# EAGLE design benzinPWM_v1 (EAGLE 5.10)
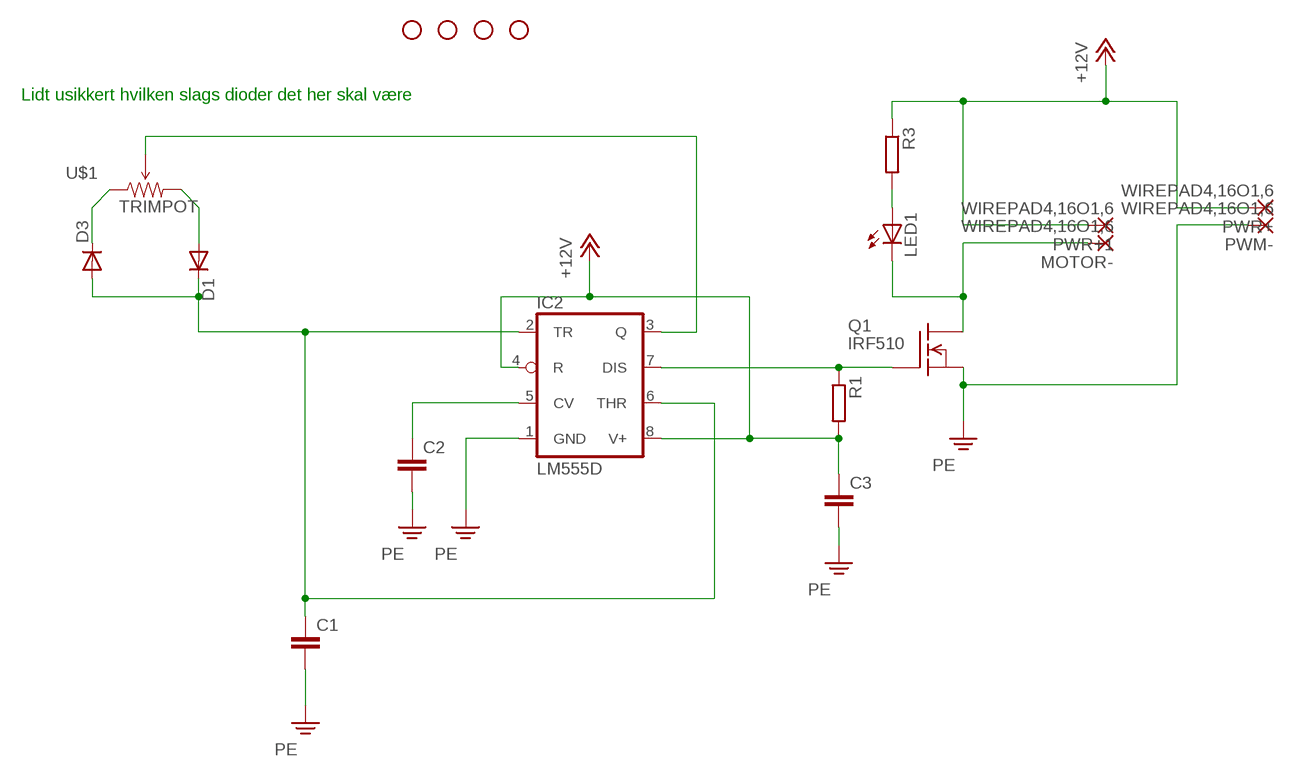
[diagram p0: schematic, sheet 1]

## Parts
C1  C-EUC0805  [C0805]
C2  C-EUC0805  [C0805]
C3  C-EUC0805  [C0805]
D1  DIODE-GF1  [GF1]
D3  DIODE-GF1  [GF1]
IC2  LM555D  [SO08]
JP3  STAND-OFF  [STAND-OFF]
JP4  STAND-OFF  [STAND-OFF]
JP5  STAND-OFF  [STAND-OFF]
JP6  STAND-OFF  [STAND-OFF]
LED1  LEDCHIPLED_0805  [CHIPLED_0805]
MOTOR-  WIREPAD4,16O1,6  [4,16O1,6]
PWM-  WIREPAD4,16O1,6  [4,16O1,6]
PWR+  WIREPAD4,16O1,6  [4,16O1,6]
PWR+1  WIREPAD4,16O1,6  [4,16O1,6]
Q1  IRF510  [TO220]
R1  R-EU_M0805  [M0805]
R3  R-EU_M0805  [M0805]
U$1  TRIMPOT  [3362U-2]

## Nets
+12V: C3.1 IC2.4(R) IC2.8(V+) PWR+1.1(P) PWR+.1(P) R1.2 R3.1
N$1: C1.1 D1.C D3.A IC2.2(TR) IC2.6(THR)
N$2: D1.A U$1.3(CW)
N$3: D3.C U$1.1(CCW)
N$5: C2.1 IC2.5(CV)
N$6: IC2.7(DIS) Q1.1(G) R1.1
N$7: LED1.A R3.2
N$8: IC2.3(Q) U$1.2(WIPER)
N$10: LED1.C MOTOR-.1(P) Q1.2(D)
PE: C1.2 C2.2 C3.2 IC2.1(GND) PWM-.1(P) Q1.3(S)

## Notes on the sheet
- Lidt usikkert hvilken slags dioder det her skal være

## Library data of the parts
C1-C3 = rcl:C-EU: CAPACITOR, European symbol
D1 D3 = diode:DIODE-: DIODE
IC2 = linear:*555: TIMER
JP3-JP6 = SparkFun:STAND-OFF: Stand Off This is the mechanical footprint for a #4 phillips button head screw. Use the keepout ring to avoid running the screw head into surrounding components. SKU : PRT-00447
LED1 = led:LED: LED OSRAM: - CHIPLED LG R971, LG N971, LY N971, LG Q971, LY Q971, LO R971, LY R971 LH N974, LH R974 LS Q976, LO Q976, LY Q976 LO Q996 - Hyper CHIPLED LW Q18S LB Q993, LB Q99A, LB R99A - SideLED LS A670, LO A670, LY A670, LG A670, LP A670 LB A673, LV A673, LT A673, LW A673 LH A674 LY A675 LS A676, LA A676, LO A676, LY A676, LW A676 LS A679, LY A679, LG A679 - Hyper Micro SIDELED® LS Y876, LA Y876, LO Y876, LY Y876 LT Y87S - SmartLED LW L88C, LW L88S LB L89C, LB L89S, LG L890 LS L89K, LO L89K, LY L89K LS L896, LA L896, LO L896, LY L896 - TOPLED LS T670, LO T670, LY T670, LG T670, LP T670 LSG T670, LSP T670, LSY T670, LOP T670, LYG T670 LG T671, LOG T671, LSG T671 LB T673, LV T673, LT T673, LW T673 LH T674 LS T676, LA T676, LO T676, LY T676, LB T676, LH T676, LSB T676, LW T676 LB T67C, LV T67C, LT T67C, LS T67K, LO T67K, LY T67K, LW E67C LS E67B, LA E67B, LO E67B, LY E67B, LB E67C, LV E67C, LT E67C LW T67C LS T679, LY T679, LG T679 LS T770, LO T770, LY T770, LG T770, LP T770 LB T773, LV T773, LT T773, LW T773 LH T774 LS E675, LA E675, LY E675, LS T675 LS T776, LA T776, LO T776, LY T776, LB T776 LHGB T686 LT T68C, LB T68C - Hyper Mini TOPLED® LB M676 - Mini TOPLED Santana® LG M470 LS M47K, LO M47K, LY M47K Source: http://www.osram.convergy.de LUXEON: - LUMILED® LXK2-PW12-R00, LXK2-PW12-S00, LXK2-PW14-U00, LXK2-PW14-V00 LXK2-PM12-R00, LXK2-PM12-S00, LXK2-PM14-U00 LXK2-PE12-Q00, LXK2-PE12-R00, LXK2-PE12-S00, LXK2-PE14-T00, LXK2-PE14-U00 LXK2-PB12-K00, LXK2-PB12-L00, LXK2-PB12-M00, LXK2-PB14-N00, LXK2-PB14-P00, LXK2-PB14-Q00 LXK2-PR12-L00, LXK2-PR12-M00, LXK2-PR14-Q00, LXK2-PR14-R00 LXK2-PD12-Q00, LXK2-PD12-R00, LXK2-PD12-S00 LXK2-PH12-R00, LXK2-PH12-S00 LXK2-PL12-P00, LXK2-PL12-Q00, LXK2-PL12-R00 Source: www.luxeon.com KINGBRIGHT: KA-3528ASYC Source: www.kingbright.com
MOTOR- PWM- PWR+ PWR+1 = wirepad:WIREPAD: Wire PAD connect wire on PCB
Q1 = transistor-fet:IRF510: N-Channel Enhancement MOSFET (HEXFET); 100V; 5,6A; 0,54Ohm
R1 R3 = resistor:R-EU_: RESISTOR, European symbol
U$1 = SparkFun:TRIMPOT

## Board
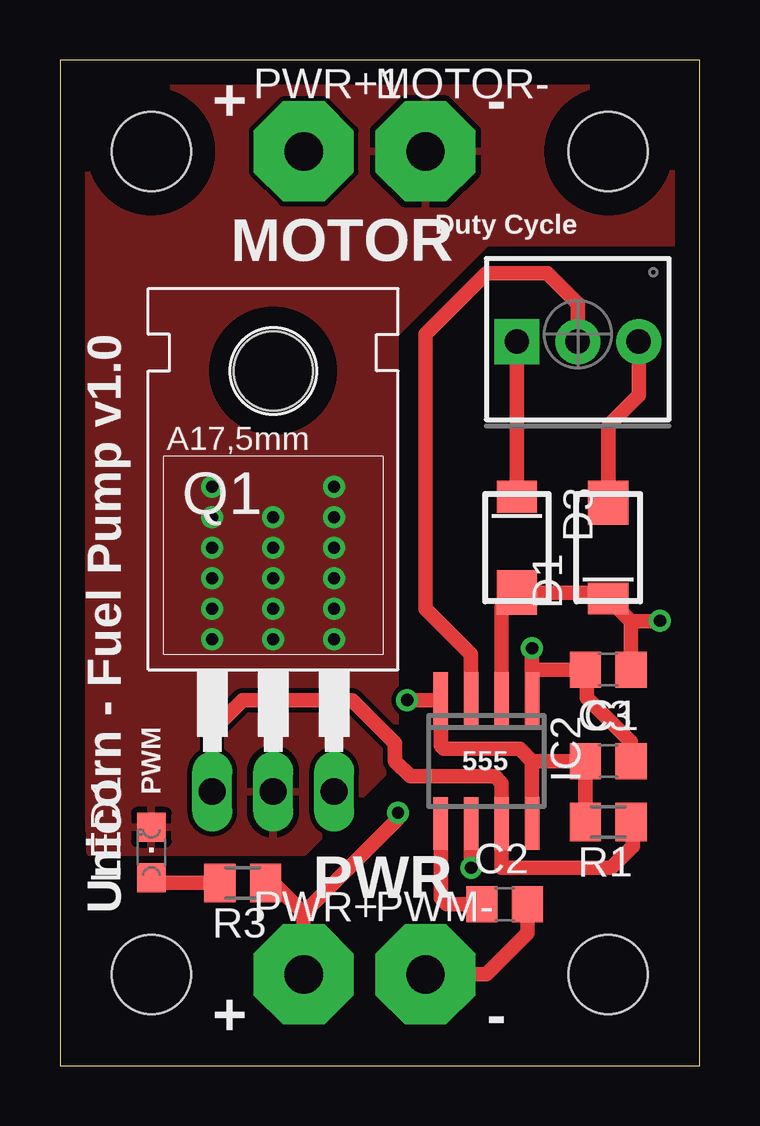
[diagram p1: board, top side]
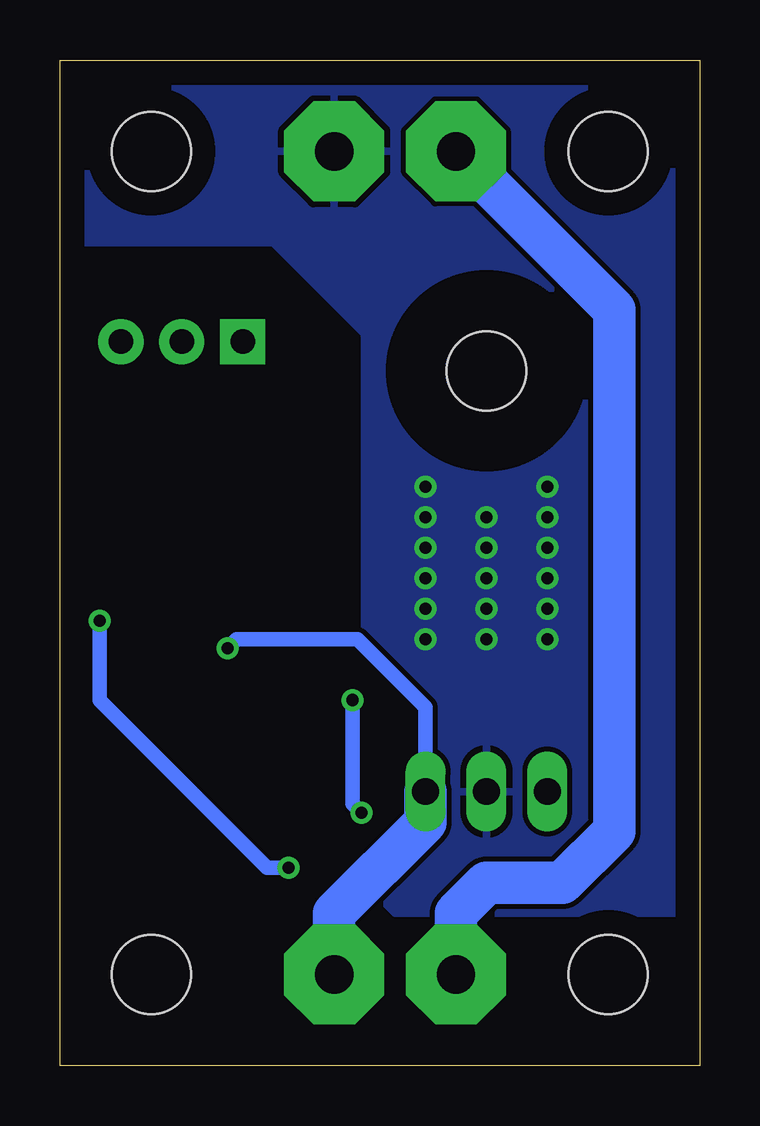
[diagram p2: board, bottom side, seen from below]

Size 26.67 x 41.91 mm. Coordinates in mm from the lower left corner, seen from the top.
Outline: 0,0 26.67,0 26.67,41.91 0,41.9 0,0
Copper layers (1*16): Top 0.035mm / dielectric 1.5mm / Bottom 0.035mm
Design rules "batchPCBrules": minimum track width 10mil, minimum drill 20mil, track to track 8mil, track to pad 8mil, pad to pad 8mil, via to via 8mil, smd to smd 8mil, copper to edge 40mil, drill to drill 8mil, minimum pad ring 10mil, minimum via ring 8mil, stop-mask expansion 4mil, vias tented up to drill 0mil, thermal gap 10mil

### Footprints (pad centres in the part's own frame; a part is rotated, then mirrored left to right if it is on the bottom)
C0805 = smd 1.3 x 1.5: 1 -0.95,0; 2 0.95,0
GF1 = smd 1.85 x 1.68: A 1.87,0 | smd 1.32 x 1.68: C -2.12,0
SO08 = smd 0.6 x 2.2: 1 -1.905,-2.6; 2 -0.635,-2.6; 3 0.635,-2.6; 4 1.905,-2.6; 5 1.905,2.6; 6 0.635,2.6; 7 -0.635,2.6; 8 -1.905,2.6
STAND-OFF = hole 3.302: 0,0
CHIPLED_0805 = smd 1.2 x 1.2: A 0,-1.05; C 0,1.05
4,16O1,6 = drill 1.6 pad 4.166 octagon: 1 0,0
TO220 = drill 1.118 long: 1 -2.54,-6.35; 2 0,-6.35; 3 2.54,-6.35 | hole 3.302: 0,11.176
M0805 = smd 1.3 x 1.6: 1 -0.95,0; 2 0.95,0
3362U-2 = drill 1.016 pad 1.88 square: 1 -2.54,-0.305 | drill 1.016 pad 1.88 round: 2 0,-0.305; 3 2.54,-0.305

### Placement (x,y rotation side)
C1  22.86,16.51 180 top
C2  18.54,6.73 0 top
C3  22.86,12.7 0 top
D1  22.86,21.59 90 top
D3  19.05,21.59 270 top
IC2  17.78,12.7 180 top
JP3  22.86,38.1 0 top
JP4  3.81,38.1 0 top
JP5  22.86,3.81 0 top
JP6  3.81,3.81 0 top
LED1  3.81,8.89 0 top
MOTOR-  15.24,38.1 0 top
PWM-  15.24,3.81 0 top
PWR+  10.16,3.81 0 top
PWR+1  10.16,38.1 0 top
Q1  8.89,17.78 0 top
R1  22.86,10.16 180 top
R3  7.62,7.62 180 top
U$1  21.59,30.48 0 top

### Tracks (layer width: path | path; a pad name or v marks a point on that pad's centre or on a via)
+12V  (via drill 0.51)
  Top 0.61: 19.68,12.7 19.18,13.21 16,13.21 15.88,13.34 15.88,15.24 | 19.68,12.7 IC2.8 | 15.88,15.24 IC2.4 | R1.2 C3.1 19.68,12.7 | v14.48,15.24 15.88,15.24 | v14.1,10.54 14.1,10.29 10.16,6.35 | PWR+.1 10.16,6.35 | R3.1 8.89,7.62 10.16,6.35
  Bottom 0.61: v14.48,15.24 14.48,10.92 v14.1,10.54
  Bottom 1.778: PWR+1.1 3.56,31.5 3.56,9.78 5.71,7.62 8.89,7.62 10.16,6.35 PWR+.1
N$1  (via drill 0.51)
  Top 0.61: IC2.2 18.41,19.09 D3.A 22.61,19.72 D1.C 23.81,18.52 | IC2.6 v17.14,8.26 | 23.81,18.52 C1.1 | 23.81,18.52 24.87,18.52 v25.02,18.54
  Bottom 0.61: v17.14,8.26 18.03,8.26 25.02,15.24 v25.02,18.54
N$2
  Top 0.61: D1.A 22.86,26.67 24.13,27.94 U$1.3
N$3
  Top 0.61: D3.C U$1.1
N$5
  Top 0.61: IC2.5 15.88,6.99 16.13,6.73 C2.1
N$6
  Top 0.61: R1.1 23.88,10.09 23.88,9.14 22.99,8.26 18.41,8.26 IC2.7 18.41,11.78 18.13,12.06 14.61,12.06 13.97,12.7 13.97,13.44 12.17,15.24 7.62,15.24 6.35,13.97 Q1.1
N$7
  Top 0.61: R3.2 4.03,7.62 LED1.A
N$8
  Top 0.61: IC2.3 17.14,17.14 15.24,19.05 15.24,30.48 17.78,33.02 20.32,33.02 21.59,31.75 U$1.2
N$10  (via drill 0.51)
  other vias: 8.89,17.78 11.43,20.32 11.43,17.78 8.89,21.59 8.89,22.86 6.35,22.86 6.35,21.59 6.35,20.32 11.43,22.86 6.35,19.05 8.89,20.32 8.89,19.05 6.35,17.78 11.43,21.59 11.43,19.05 11.43,24.13 6.35,24.13
  pour Top: 0,41.91 1.27,8.89 10.16,8.89 13.97,12.7 13.97,30.48 17.78,34.29 26.67,34.29 26.67,41.91
  pour Bottom: 0,41.91 0,6.35 12.7,6.35 13.97,7.62 13.97,17.78 13.97,30.48 16.51,33.02 17.78,34.29 26.67,34.29 26.67,41.91
PE  (via drill 0.51)
  Top 0.61: v19.68,17.4 19.68,16.51 | 19.68,16.51 IC2.1 | 19.68,16.51 C1.2 21.97,16.45 21.97,15.35 23.81,13.51 C3.2 | C2.2 19.49,5.52 17.78,3.81 PWM-.1
  Bottom 0.61: Q1.3 11.43,14.94 14.27,17.78 19.3,17.78 v19.68,17.4
  Bottom 1.778: Q1.3 11.43,10.16 15.24,6.35 PWM-.1

### Text on the board
tPlace: + | - | Duty Cycle | MOTOR | 555 | PWM | PWR | Unicorn - Fuel Pump v1.0 | + | -